# EAGLE schematic RGB_LED_Controller (EAGLE 5.10)
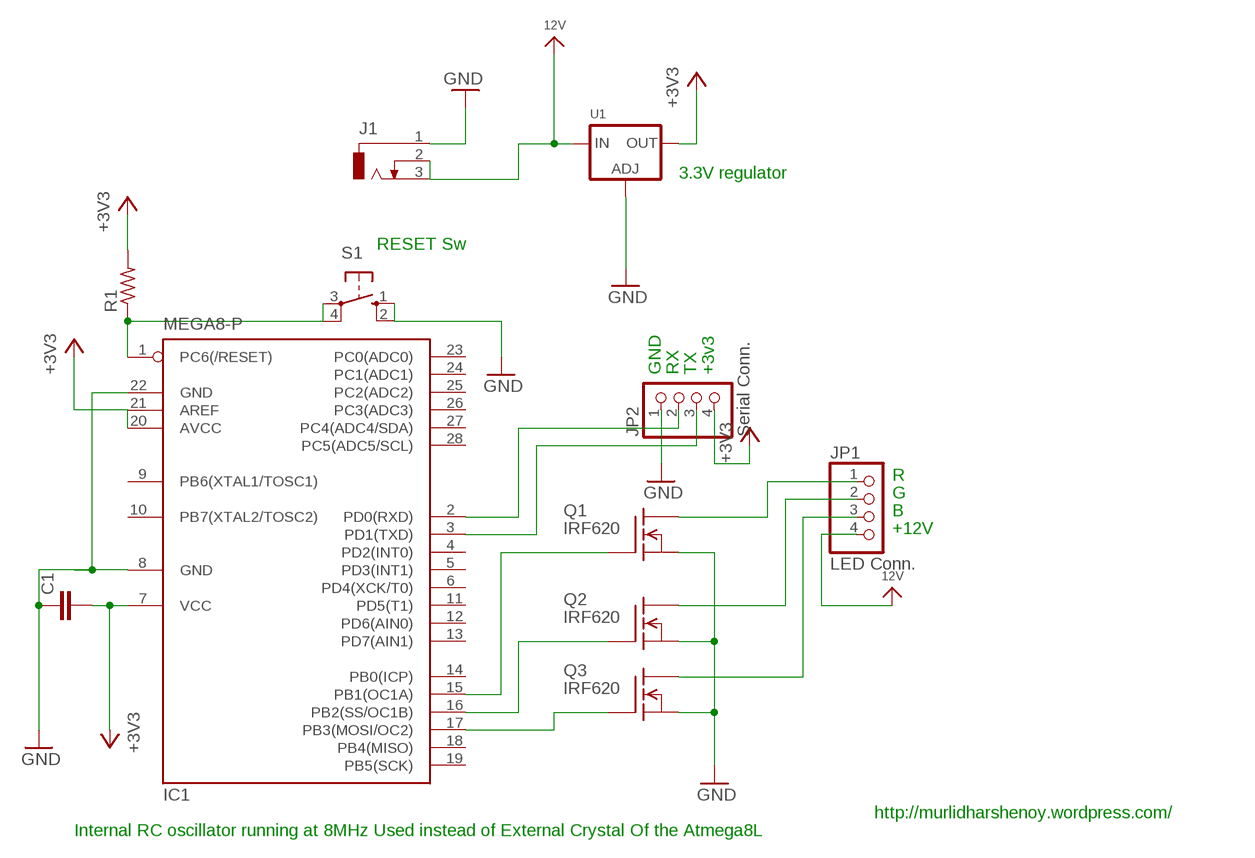
[diagram p0: schematic, sheet 1]

## Parts
C1  C-EU075-032X103  [C075-032X103]
IC1  MEGA8-P  [DIL28-3]
J1  DCJ0303  [DCJ0303]
JP1  LED Conn.  HEADER-1X476MIL  [1X04_ROUND_76]
JP2  Serial Conn.  HEADER-1X476MIL  [1X04_ROUND_76]
Q1  IRF620  [TO220]
Q2  IRF620  [TO220]
Q3  IRF620  [TO220]
R1  R-US_0309/12  [0309/12]
S1  10-XX  [B3F-10XX]
U1  LM1117SOT223-WAVE  [SOT223-W]

## Nets
12V: J1.2 J1.3 JP1.4 U1.3(IN)
+3V3: C1.2 IC1.7(VCC) IC1.21(AREF) JP2.4 R1.2 U1.2(OUT)
GND: C1.1 IC1.8(GND) IC1.22(GND) J1.1 JP2.1 Q1.3(S) Q2.3(S) Q3.3(S) S1.1(S) S1.2(S1) U1.1(ADJ)
N$1: IC1.15(PB1(OC1A)) Q1.1(G)
N$2: IC1.16(PB2(SS/OC1B)) Q2.1(G)
N$3: IC1.17(PB3(MOSI/OC2)) Q3.1(G)
N$4: IC1.1(PC6(/RESET)) R1.1 S1.3(P) S1.4(P1)
N$6: JP1.1 Q1.2(D)
N$7: JP1.2 Q2.2(D)
N$8: JP1.3 Q3.2(D)
N$10: IC1.2(PD0(RXD)) JP2.2
N$11: IC1.3(PD1(TXD)) JP2.3
Unconnected: IC1.4(PD2(INT0)) IC1.5(PD3(INT1)) IC1.6(PD4(XCK/T0)) IC1.9(PB6(XTAL1/TOSC1)) IC1.10(PB7(XTAL2/TOSC2)) IC1.11(PD5(T1)) IC1.12(PD6(AIN0)) IC1.13(PD7(AIN1)) IC1.14(PB0(ICP)) IC1.18(PB4(MISO)) IC1.19(PB5(SCK)) IC1.23(PC0(ADC0)) IC1.24(PC1(ADC1)) IC1.25(PC2(ADC2)) IC1.26(PC3(ADC3)) IC1.27(PC4(ADC4/SDA)) IC1.28(PC5(ADC5/SCL))

## Notes on the sheet
- 3.3V regulator
- RESET Sw
- GND | RX | TX | +3v3
- R
- G
- B
- +12V
- http://murlidharshenoy.wordpress.com/
- Internal RC oscillator running at 8MHz Used instead of External Crystal Of the Atmega8L

## Power pins joined to a net without a drawn wire
AVCC: IC1.20(AVCC)

## Library data of the parts
C1 = rcl:C-EU: CAPACITOR, European symbol
IC1 = atmel:MEGA8-P: MICROCONTROLLER 8 Kbytes FLASH, 1 kbytes SRAM, 512 bytes EEPROM, USART, 4-channel 10 bit ADC, 2-channel 8 bit ADC Pin compatible with Atmega48, ATMega88, ATMega168 Source: avr.lbr
J1 = con-jack:DCJ0303: DC POWER JACK Source: DCJ0303.pdf
JP1 JP2 = microbuilder:HEADER-1X4: PIN HEADER
Q1-Q3 = transistor-fet:IRF620: N-Channel Enhancement MOSFET (HEXFET); 200V; 5,2A; 0,8Ohm
R1 = rcl:R-US_: RESISTOR, American symbol
S1 = switch-omron:10-XX: OMRON SWITCH
U1 = microbuilder:LM1117: LM1117 Voltage Regulator LM1117 Adjustable Voltage regulator [Digikey: LM1117IMP-ADJDKR-ND] LM1117 3.3V Voltage regulator [AP1117E33GDIDKR-ND] LM1117 5.0V Voltage regulator [AP1117E50GDIDKR-ND] SOT223-REFLOW - SOT223 package for solder paste/reflow ovens SOT223-WAVE - SOT223 package for hand-soldering (larger pads) Note: For the fixed-voltage regulators, simply set the ADJ pin to GND.